# Altium schematic sheet Large_Relay.SchDoc: High Current Relay
size A4; Organization: Altium Limited; Address1: L3, 12a Rodborough Rd; Address2: Frenchs Forest; Address3: NSW; Address4: Australia 2086
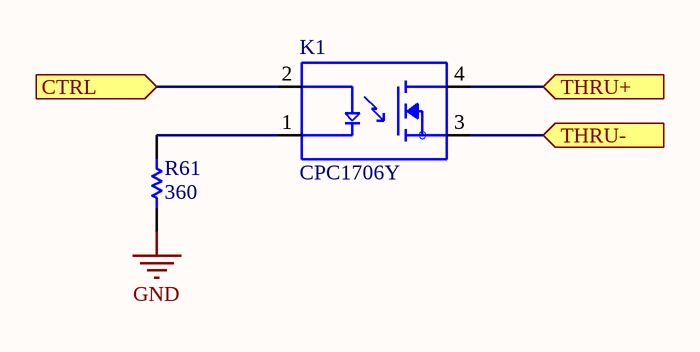
[diagram p0: Large_Relay.SchDoc]

## Parts
K1  CPC1706Y  [RELAY_CPC1706Y]
R61  360  [0402_Res]

## Ports
CTRL (in), THRU+ (in), THRU- (in)

## Nets
GND: R61.1
CTRL: K1.2 ; port CTRL
THRU+: K1.4 ; port THRU+
THRU-: K1.3 ; port THRU-
NetK1_1: K1.1 R61.2

## Notes on the sheet
- Title
- Date:
- RE:
- Arturo di Girolamo
- Size:
- A3
- A

## Library data of the parts
K1 = CPC1706Y: Solid State SPST-NO _1 Form A_ 8-SIP, 4 Leads; MF: IXYS Integrated; MP: CPC1706Y; Value: *; Package: SIP-4 IXYS; SnapEDA_Link: https://www.snapeda.com/parts/CPC1706Y/IXYS%20Integrated%20Circuits%20Division/view-part/681572/?ref=snap; Price: None; Availability: Unavailable
R61 = ERJ-PB6D7501V: 7.5K 1% 1/4W; Value: 1K; ASYPN: ERJ-2GEJ361X; MFGPN: ERJ-PB6D7501V